# Altium schematic sheet Power.SchDoc
size A
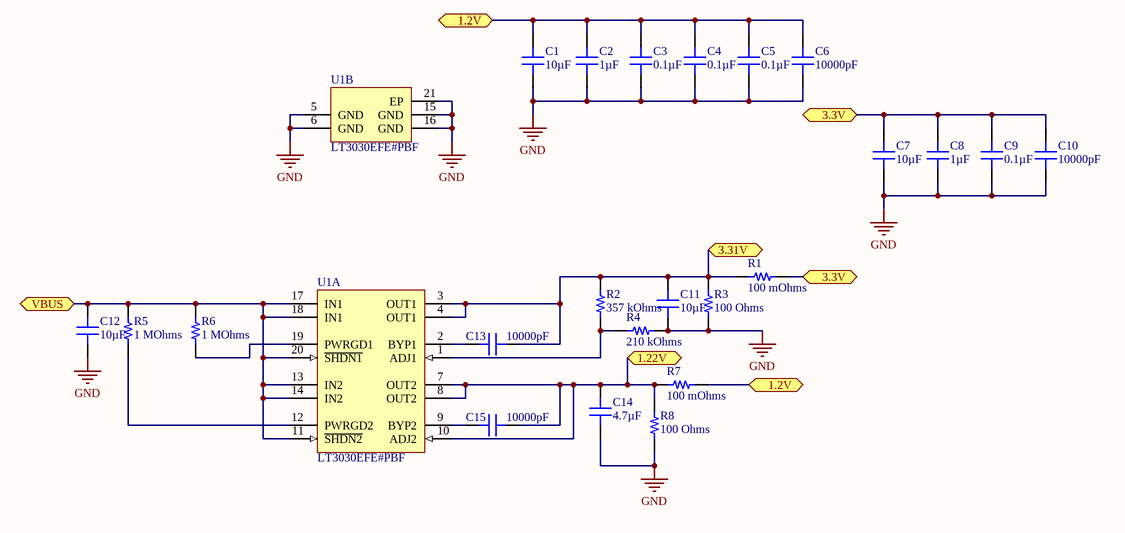
[diagram p0: Power.SchDoc]

## Parts
C1  10µF  [CAP 0805_2012]
C2  1µF  [CAP 0805_2012]
C3  0.1µF  [CAP 0805_2012]
C4  0.1µF  [CAP 0805_2012]
C5  0.1µF  [CAP 0805_2012]
C6  10000pF  [CAP 0805_2012]
C7  10µF  [CAP 0805_2012]
C8  1µF  [CAP 0805_2012]
C9  0.1µF  [CAP 0805_2012]
C10  10000pF  [CAP 0805_2012]
C11  10µF  [CAP 0805_2012]
C12  10µF  [CAP 0805_2012]
C13  10000pF  [CAP 0805_2012]
C14  4.7µF  [CAP 0805_2012]
C15  10000pF  [CAP 0805_2012]
R1  100 mOhms  [RES 0805_2012]
R2  357 kOhms  [RES 0805_2012]
R3  100 Ohms  [RES 0805_2012]
R4  210 kOhms  [RES 0805_2012]
R5  1 MOhms  [RES 0805_2012]
R6  1 MOhms  [RES 0805_2012]
R7  100 mOhms  [RES 0805_2012]
R8  100 Ohms  [RES 0805_2012]
U1  LT3030EFE#PBF  [LT-FE-20-EPV-CB_M]  (parts A,B of 2)

## Ports
1.2V (bidir), 1.22V (bidir), 3.3V (bidir), 3.31V (bidir), VBUS (bidir)

## Nets
GND: C1.1 C2.1 C3.1 C4.1 C5.1 C6.2 C7.1 C8.1 C9.1 C10.2 C11.1 C12.1 C14.1 R3.1 R4.2 R8.1 U1.5(GND) U1.6(GND) U1.15(GND) U1.16(GND) U1.21(EP)
1.2V: C1.2 C2.2 C3.2 C4.2 C5.2 C6.1 R7.2 ; port 1.2V
1.22V: C14.2 C15.1 R7.1 R8.2 U1.7(OUT2) U1.8(OUT2) U1.10(ADJ2) ; port 1.22V
3.3V: C7.2 C8.2 C9.2 C10.1 R1.2 ; port 3.3V
3.31V: C11.2 C13.1 R1.1 R2.2 R3.2 U1.3(OUT1) U1.4(OUT1) ; port 3.31V
VBUS: C12.2 R5.2 R6.2 U1.11(~{SHDN2}) U1.13(IN2) U1.14(IN2) U1.17(IN1) U1.18(IN1) U1.20(~{SHDN1}) ; port VBUS
NetC13_2: C13.2 U1.2(BYP1)
NetC15_2: C15.2 U1.9(BYP2)
NetR2_1: R2.1 R4.1 U1.1(ADJ1)
NetR5_1: R5.1 U1.12(PWRGD2)
NetR6_1: R6.1 U1.19(PWRGD1)

## Library data of the parts
C1 C7 C11 C12 = CL21A106KOQNNNG: CAP CER 10UF 16V X5R 0805; Manufacturer: Samsung Electro-Mechanics; Tolerance: ±10%; Part Number: CL21A106KOQNNNG; Value: 10µF; Applications: General Purpose; Capacitance: 10µF; ComponentLink1Description: Datasheet; ComponentLink1URL: http://www.samsungsem.com/kr/support/product-search/mlcc/CL21A106KOQNNNG.jsp; ComponentLink2Description: DigiKey Link; ComponentLink2URL: http://digikey.com/product-detail/en/samsung-electro-mechanics/CL21A106KOQNNNG/1276-6455-1-ND/5958083; Device Package: 0805 (2012 Metric); LastUpdated: 9/2/2020 1:04:35 AM; Lifecycle Status: Active; Minimum Order: 1; Mounting Type: Surface Mount, MLCC; Operating Temperature: -55°C ~ 85°C; Package / Case: 0805 (2012 Metric); Packaging: TapeAndReel; PartId: 6236; Part Status: Active; Price: 0.02; Series: CL; Size / Dimension: 0.079" L x 0.049" W (2.00mm x 1.25mm); Supplier 1: DigiKey; Supplier Part Number 1: 1276-6455-1-ND; Temperature Coefficient: X5R; Thickness (Max): 0.055" (1.40mm); Voltage - Rated: 16V
C2 C8 = CL21B105KAFNNNE: CAP CER 1UF 25V X7R 0805; Manufacturer: Samsung Electro-Mechanics; Tolerance: ±10%; Part Number: CL21B105KAFNNNE; Value: 1µF; Applications: General Purpose; Capacitance: 1µF; ComponentLink1Description: Datasheet; ComponentLink1URL: http://www.samsungsem.com/kr/support/product-search/mlcc/CL21B105KAFNNNE.jsp; ComponentLink2Description: DigiKey Link; ComponentLink2URL: http://digikey.com/product-detail/en/samsung-electro-mechanics/CL21B105KAFNNNE/1276-1066-1-ND/3889152; Device Package: 0805 (2012 Metric); LastUpdated: 9/2/2020 1:04:35 AM; Lifecycle Status: Active; Minimum Order: 1; Mounting Type: Surface Mount, MLCC; Operating Temperature: -55°C ~ 125°C; Package / Case: 0805 (2012 Metric); Packaging: TapeAndReel; PartId: 6211; Part Status: Active; Price: 0.02; Series: CL; Size / Dimension: 0.079" L x 0.049" W (2.00mm x 1.25mm); Supplier 1: DigiKey; Supplier Part Number 1: 1276-1066-1-ND; Temperature Coefficient: X7R; Thickness (Max): 0.053" (1.35mm); Voltage - Rated: 25V
C3-C5 C9 = CL21B104KBCNNNC: CAP CER 0.1UF 50V X7R 0805; Manufacturer: Samsung Electro-Mechanics; Tolerance: ±10%; Part Number: CL21B104KBCNNNC; Value: 0.1µF; Applications: General Purpose; Capacitance: 0.1µF; ComponentLink1Description: Datasheet; ComponentLink1URL: http://www.samsungsem.com/kr/support/product-search/mlcc/CL21B104KBCNNNC.jsp; ComponentLink2Description: DigiKey Link; ComponentLink2URL: http://digikey.com/product-detail/en/samsung-electro-mechanics/CL21B104KBCNNNC/1276-1003-1-ND/3889089; Device Package: 0805 (2012 Metric); LastUpdated: 9/2/2020 1:04:35 AM; Lifecycle Status: Active; Minimum Order: 1; Mounting Type: Surface Mount, MLCC; Operating Temperature: -55°C ~ 125°C; Package / Case: 0805 (2012 Metric); Packaging: TapeAndReel; PartId: 6201; Part Status: Active; Price: 0.01; Series: CL; Size / Dimension: 0.079" L x 0.049" W (2.00mm x 1.25mm); Supplier 1: DigiKey; Supplier Part Number 1: 1276-1003-1-ND; Temperature Coefficient: X7R; Thickness (Max): 0.037" (0.95mm); Voltage - Rated: 50V
C6 C10 C13 C15 = CL21B103KBANNNC: CAP CER 10000PF 50V X7R 0805; Manufacturer: Samsung Electro-Mechanics; Tolerance: ±10%; Part Number: CL21B103KBANNNC; Value: 10000pF; Applications: General Purpose; Capacitance: 10000pF; ComponentLink1Description: Datasheet; ComponentLink1URL: http://www.samsungsem.com/kr/support/product-search/mlcc/CL21B103KBANNNC.jsp; ComponentLink2Description: DigiKey Link; ComponentLink2URL: http://digikey.com/product-detail/en/samsung-electro-mechanics/CL21B103KBANNNC/1276-1015-1-ND/3889101; Device Package: 0805 (2012 Metric); LastUpdated: 9/2/2020 1:04:35 AM; Lifecycle Status: Active; Minimum Order: 1; Mounting Type: Surface Mount, MLCC; Operating Temperature: -55°C ~ 125°C; Package / Case: 0805 (2012 Metric); Packaging: TapeAndReel; PartId: 6199; Part Status: Active; Price: 0.01; Series: CL; Size / Dimension: 0.079" L x 0.049" W (2.00mm x 1.25mm); Supplier 1: DigiKey; Supplier Part Number 1: 1276-1015-1-ND; Temperature Coefficient: X7R; Thickness (Max): 0.030" (0.75mm); Voltage - Rated: 50V
C14 = CL21A475KAQNNNE: CAP CER 4.7UF 25V X5R 0805; Manufacturer: Samsung Electro-Mechanics; Tolerance: ±10%; Part Number: CL21A475KAQNNNE; Value: 4.7µF; Applications: General Purpose; Capacitance: 4.7µF; ComponentLink1Description: Datasheet; ComponentLink1URL: http://www.samsungsem.com/kr/support/product-search/mlcc/CL21A475KAQNNNE.jsp; ComponentLink2Description: DigiKey Link; ComponentLink2URL: http://digikey.com/product-detail/en/samsung-electro-mechanics/CL21A475KAQNNNE/1276-1244-1-ND/3889330; Device Package: 0805 (2012 Metric); LastUpdated: 9/2/2020 1:04:19 AM; Lifecycle Status: Active; Minimum Order: 1; Mounting Type: Surface Mount, MLCC; Operating Temperature: -55°C ~ 85°C; Package / Case: 0805 (2012 Metric); Packaging: TapeAndReel; PartId: 14321; Part Status: Active; Price: 0.03; Series: CL; Size / Dimension: 0.079" L x 0.049" W (2.00mm x 1.25mm); Supplier 1: DigiKey; Supplier Part Number 1: 1276-1244-1-ND; Temperature Coefficient: X5R; Thickness (Max): 0.055" (1.40mm); Voltage - Rated: 25V
R1 R7 = RL1220S-R10-F: RES 0.1 OHM 1% 1/3W 0805; Manufacturer: Susumu; Power (Watts): 0.333W, 1/3W; Temperature Coefficient: 0/ +200ppm/°C; Part Number: RL1220S-R10-F; Value: 100 mOhms; ComponentLink1Description: Datasheet; ComponentLink1URL: http://www.susumu.co.jp/common/pdf/n_catalog_partition08_en.pdf; ComponentLink2Description: DigiKey Link; ComponentLink2URL: http://digikey.com/product-detail/en/susumu/RL1220S-R10-F/RL12S.10FCT-ND/433019; Composition: Thin Film; Device Package: 0805 (2012 Metric); Features: Current Sense; Height - Seated (Max): 0.020" (0.50mm); LastUpdated: 9/2/2020 1:15:23 AM; Lifecycle Status: Active; Minimum Order: 1; Number of Terminations: 2; Operating Temperature: -55°C ~ 125°C; Package / Case: 0805 (2012 Metric); Packaging: TapeAndReel; PartId: 28050; Part Status: Active; Price: 0.03; Resistance: 100 mOhms; Series: RL; Size / Dimension: 0.079" L x 0.049" W (2.00mm x 1.25mm); Supplier 1: DigiKey; Supplier Part Number 1: RL12S.10FCT-ND; Supplier Device Package: 0805; Tolerance: ±1%
R2 = ERJ-6ENF3573V: RES SMD 357K OHM 1% 1/8W 0805; Manufacturer: Panasonic Electronic Components; Power (Watts): 0.125W, 1/8W; Temperature Coefficient: ±100ppm/°C; Part Number: ERJ-6ENF3573V; Value: 357 kOhms; ComponentLink1Description: Datasheet; ComponentLink1URL: https://industrial.panasonic.com/cdbs/www-data/pdf/RDA0000/AOA0000C304.pdf; ComponentLink2Description: DigiKey Link; ComponentLink2URL: http://digikey.com/product-detail/en/panasonic-electronic-components/ERJ-6ENF3573V/P357KCCT-ND/119709; Composition: Thick Film; Device Package: 0805 (2012 Metric); Features: Automotive AEC-Q200; Height - Seated (Max): 0.028" (0.70mm); LastUpdated: 9/2/2020 1:14:35 AM; Lifecycle Status: Active; Minimum Order: 1; Number of Terminations: 2; Operating Temperature: -55°C ~ 155°C; Package / Case: 0805 (2012 Metric); Packaging: TapeAndReel; PartId: 47845; Part Status: Active; Price: 0.01; Ratings: AEC-Q200; Resistance: 357 kOhms; Series: ERJ; Size / Dimension: 0.079" L x 0.049" W (2.00mm x 1.25mm); Supplier 1: DigiKey; Supplier Part Number 1: P357KCCT-ND; Supplier Device Package: 0805; Tolerance: ±1%
R3 R8 = RNCP0805FTD100R: RES 100 OHM 1% 1/4W 0805; Manufacturer: Stackpole Electronics Inc; Power (Watts): 0.25W, 1/4W; Temperature Coefficient: ±100ppm/°C; Part Number: RNCP0805FTD100R; Value: 100 Ohms; ComponentLink1Description: Datasheet; ComponentLink1URL: https://www.seielect.com/catalog/sei-rncp.pdf; ComponentLink2Description: DigiKey Link; ComponentLink2URL: http://digikey.com/product-detail/en/stackpole-electronics-inc/RNCP0805FTD100R/RNCP0805FTD100RCT-ND/2240548; Composition: Thin Film; Device Package: 0805 (2012 Metric); Features: Anti-Sulfur, Moisture Resistant; Height - Seated (Max): 0.024" (0.60mm); LastUpdated: 9/2/2020 1:15:14 AM; Lifecycle Status: Active; Minimum Order: 1; Number of Terminations: 2; Operating Temperature: -55°C ~ 155°C; Package / Case: 0805 (2012 Metric); Packaging: TapeAndReel; PartId: 32189; Part Status: Active; Price: 0.01; Resistance: 100 Ohms; Series: RNCP; Size / Dimension: 0.079" L x 0.049" W (2.00mm x 1.25mm); Supplier 1: DigiKey; Supplier Part Number 1: RNCP0805FTD100RCT-ND; Supplier Device Package: 0805; Tolerance: ±1%
R4 = ERJ-6ENF2103V: RES SMD 210K OHM 1% 1/8W 0805; Manufacturer: Panasonic Electronic Components; Power (Watts): 0.125W, 1/8W; Temperature Coefficient: ±100ppm/°C; Part Number: ERJ-6ENF2103V; Value: 210 kOhms; ComponentLink1Description: Datasheet; ComponentLink1URL: https://industrial.panasonic.com/cdbs/www-data/pdf/RDA0000/AOA0000C304.pdf; ComponentLink2Description: DigiKey Link; ComponentLink2URL: http://digikey.com/product-detail/en/panasonic-electronic-components/ERJ-6ENF2103V/P210KCCT-ND/119643; Composition: Thick Film; Device Package: 0805 (2012 Metric); Features: Automotive AEC-Q200; Height - Seated (Max): 0.028" (0.70mm); LastUpdated: 9/2/2020 1:14:42 AM; Lifecycle Status: Active; Minimum Order: 1; Number of Terminations: 2; Operating Temperature: -55°C ~ 155°C; Package / Case: 0805 (2012 Metric); Packaging: TapeAndReel; PartId: 46340; Part Status: Active; Price: 0.01; Ratings: AEC-Q200; Resistance: 210 kOhms; Series: ERJ; Size / Dimension: 0.079" L x 0.049" W (2.00mm x 1.25mm); Supplier 1: DigiKey; Supplier Part Number 1: P210KCCT-ND; Supplier Device Package: 0805; Tolerance: ±1%
R5 R6 = RMCF0805FG1M00: RES 1M OHM 1% 1/8W 0805; Manufacturer: Stackpole Electronics Inc; Power (Watts): 0.125W, 1/8W; Temperature Coefficient: ±100ppm/°C; Part Number: RMCF0805FG1M00; Value: 1 MOhms; ComponentLink1Description: Datasheet; ComponentLink1URL: https://www.seielect.com/catalog/sei-rmcf_rmcp.pdf; ComponentLink2Description: DigiKey Link; ComponentLink2URL: http://digikey.com/product-detail/en/stackpole-electronics-inc/RMCF0805FG1M00/RMCF0805FG1M00CT-ND/4425150; Composition: Thick Film; Device Package: 0805 (2012 Metric); Features: Automotive AEC-Q200; Height - Seated (Max): 0.026" (0.65mm); LastUpdated: 9/2/2020 1:14:43 AM; Lifecycle Status: Active; Minimum Order: 1; Number of Terminations: 2; Operating Temperature: -55°C ~ 155°C; Package / Case: 0805 (2012 Metric); Packaging: CutTape; PartId: 46208; Part Status: Active; Price: 0.10; Ratings: AEC-Q200; Resistance: 1 MOhms; Series: RMCF; Size / Dimension: 0.079" L x 0.049" W (2.00mm x 1.25mm); Supplier 1: DigiKey; Supplier Part Number 1: RMCF0805FG1M00CT-ND; Supplier Device Package: 0805; Tolerance: ±1%
U1 = CMP-0476-00593-1: Dual 750 mA / 250 mA Low Dropout, Low Noise, Micropower Linear Regulator, 1.7 to 20 V Vin, Adjustable Vout, 20-pin SOP (FE-20-EPV-CB), -40 to 125 degC, Pb-Free; Manufacturer: Linear Technology; Noise(uV): 20; Vout Max(V): 19.5; Output Voltage: Adj; Number of Outputs: 2; Vout Min(V): 1.22; Iout(mA): 750; PSRR(dB): 60; Vin Min(V): 1.7; Isupply(mA): 15; Discrete Pass Element: no; Dropout Voltage(V): 0.3; Vin Max(V): 20; ComponentLink1URL: http://www.linear.com/; DatasheetVersion: Rev. A; PartNumber: LT3030EFE#PBF; PackageDescription: 20-Pin Plastic TSSOP, Body 6.5 x 4.4 mm, Pitch 0.65 mm; PackageReference: FE-20; ComponentLink2Description: Datasheet; PackageVersion: Rev. I, 05/2011; ComponentLink3Description: Package Specification; Mounting Technology: Surface Mount; ComponentLink3URL: http://cds.linear.com/docs/en/packaging/05081663__J_FE20(CB).pdf; ComponentLink2URL: http://cds.linear.com/docs/en/datasheet/3030fa.pdf; RoHS: TRUE; ComponentLink1Description: Manufacturer URL; Shutdown Current(uA): 0.3